# EAGLE design DAC_GainOutputStage7 (EAGLE 9.6.2)
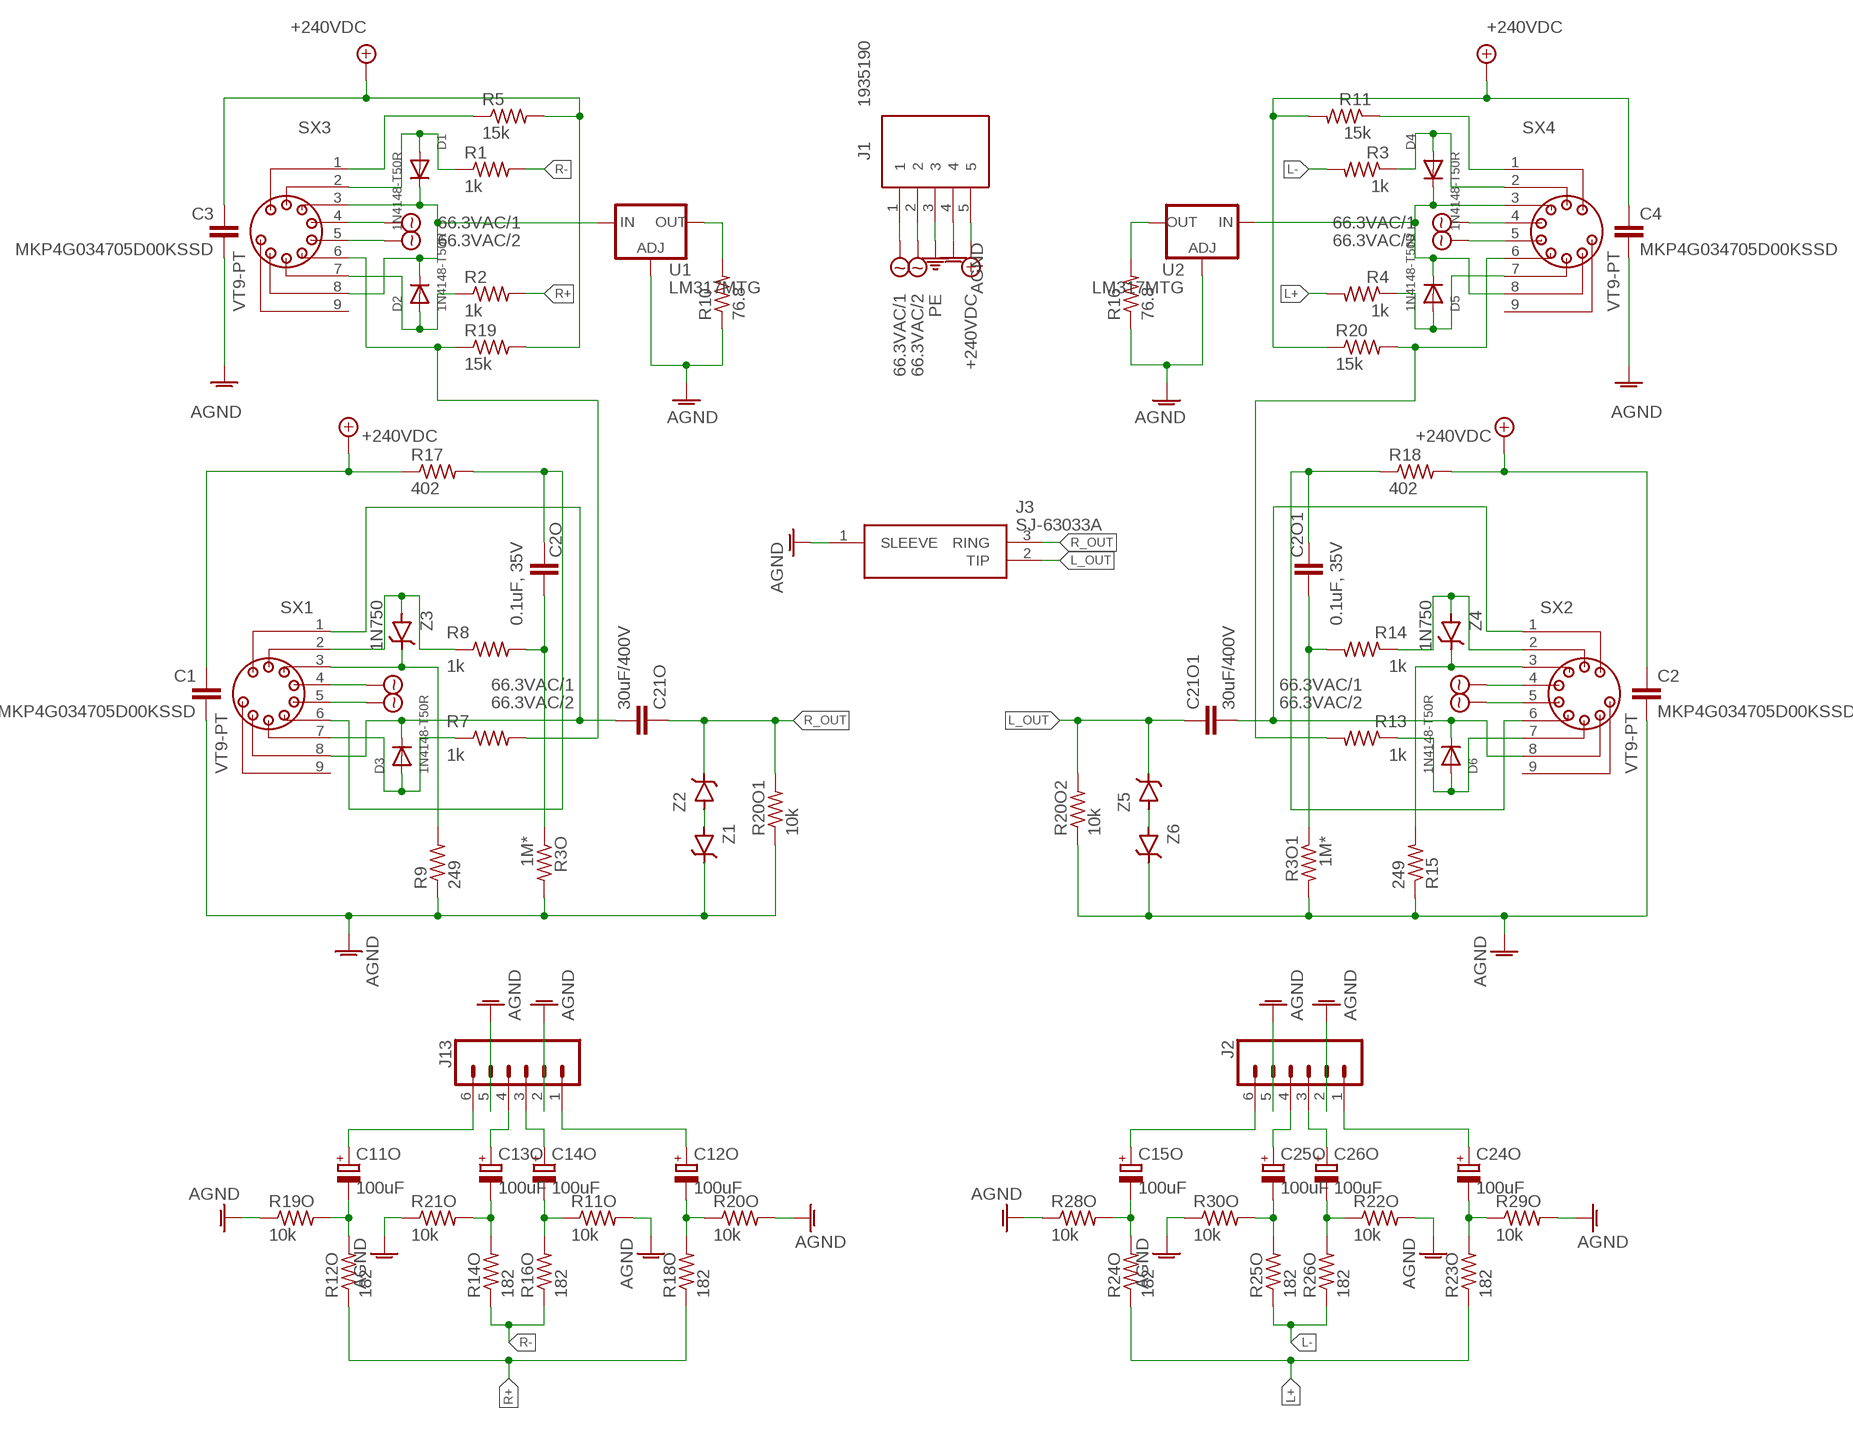
[diagram p0: schematic, sheet 1]

## Parts
C1  MKP4G034705D00KSSD  [MKP4G034705D00KSSD]
C2  MKP4G034705D00KSSD  [MKP4G034705D00KSSD]
C2O  0.1uF, 35V  MKS4B031002A00JC00  [MKS4B031002A00JC00]
C2O1  0.1uF, 35V  MKS4B031002A00JC00  [MKS4B031002A00JC00]
C3  MKP4G034705D00KSSD  [MKP4G034705D00KSSD]
C4  MKP4G034705D00KSSD  [MKP4G034705D00KSSD]
C11O  100uF  UFW1H101MPD1TD  [CAPPRD350W60D825H1300]
C12O  100uF  UFW1H101MPD1TD  [CAPPRD350W60D825H1300]
C13O  100uF  UFW1H101MPD1TD  [CAPPRD350W60D825H1300]
C14O  100uF  UFW1H101MPD1TD  [CAPPRD350W60D825H1300]
C15O  100uF  UFW1H101MPD1TD  [CAPPRD350W60D825H1300]
C21O  30uF/400V  DCP4G053006ID2KSSD  [DCP4G053006ID2KSSD]
C21O1  30uF/400V  DCP4G053006ID2KSSD  [DCP4G053006ID2KSSD]
C24O  100uF  UFW1H101MPD1TD  [CAPPRD350W60D825H1300]
C25O  100uF  UFW1H101MPD1TD  [CAPPRD350W60D825H1300]
C26O  100uF  UFW1H101MPD1TD  [CAPPRD350W60D825H1300]
D1  1N4148-T50R  [DIOAD1068W53L380D172]
D2  1N4148-T50R  [DIOAD1068W53L380D172]
D3  1N4148-T50R  [DIOAD1068W53L380D172]
D4  1N4148-T50R  [DIOAD1068W53L380D172]
D5  1N4148-T50R  [DIOAD1068W53L380D172]
D6  1N4148-T50R  [DIOAD1068W53L380D172]
J1  1935190  [1935190]
J2  CONN_06SILK_FEMALE_PTH  [1X06]
J3  SJ-63033A  [SJ63033A]
J13  CONN_06SILK_FEMALE_PTH  [1X06]
R1  1k  LR1F1K0  [0207/10]
R2  1k  LR1F1K0  [0207/10]
R3  1k  LR1F1K0  [0207/10]
R3O  1M*  LR1F1M0  [0207/10]
R3O1  1M*  LR1F1M0  [0207/10]
R4  1k  LR1F1K0  [0207/10]
R5  15k  CPF215K000FKE14  [0411/15]
R7  1k  LR1F1K0  [0207/10]
R8  1k  LR1F1K0  [0207/10]
R9  249  MBB02070C2490FRP00  [0207/10]
R10  76.8  YR1B76R8CC  [0207/10]
R11  15k  CPF215K000FKE14  [0411/15]
R11O  10k  LR1F10K  [0207/10]
R12O  182  MF0207FTE52-182R  [0207/10]
R13  1k  LR1F1K0  [0207/10]
R14  1k  LR1F1K0  [0207/10]
R14O  182  MF0207FTE52-182R  [0207/10]
R15  249  MBB02070C2490FRP00  [0207/10]
R16  76.8  YR1B76R8CC  [0207/10]
R16O  182  MF0207FTE52-182R  [0207/10]
R17  402  RWR80S4020FRB12  [0617/22]
R18  402  RWR80S4020FRB12  [0617/22]
R18O  182  MF0207FTE52-182R  [0207/10]
R19  15k  CPF215K000FKE14  [0411/15]
R19O  10k  LR1F10K  [0207/10]
R20  15k  CPF215K000FKE14  [0411/15]
R20O  10k  LR1F10K  [0207/10]
R20O1  10k  LR1F10K  [0207/10]
R20O2  10k  LR1F10K  [0207/10]
R21O  10k  LR1F10K  [0207/10]
R22O  10k  LR1F10K  [0207/10]
R23O  182  MF0207FTE52-182R  [0207/10]
R24O  182  MF0207FTE52-182R  [0207/10]
R25O  182  MF0207FTE52-182R  [0207/10]
R26O  182  MF0207FTE52-182R  [0207/10]
R28O  10k  LR1F10K  [0207/10]
R29O  10k  LR1F10K  [0207/10]
R30O  10k  LR1F10K  [0207/10]
SX1  VT9-PT  [VT9-PT]
SX2  VT9-PT  [VT9-PT]
SX3  VT9-PT  [VT9-PT]
SX4  VT9-PT  [VT9-PT]
U1  LM317MTG  [TO254P482X997X2018-3P]
U2  LM317MTG  [TO254P482X997X2018-3P]
Z1  BZX79-C16,113  [DIOAD1165W56L425D185]
Z2  BZX79-C16,113  [DIOAD1165W56L425D185]
Z3  1N750  [DIOAD1256W56L444D203]
Z4  1N750  [DIOAD1256W56L444D203]
Z5  BZX79-C16,113  [DIOAD1165W56L425D185]
Z6  BZX79-C16,113  [DIOAD1165W56L425D185]

## Nets
66.3VAC/1 [Power]: J1.1 SX1.4 SX2.4 SX3.4 SX4.4
66.3VAC/2 [Power]: J1.2 SX1.5 SX2.5 SX3.5 SX4.5
+240VDC [Power]: C1.1 C2.1 C3.1 C4.1 J1.5 R5.2 R11.2 R17.1 R18.2 R19.2 R20.1
AGND [Power]: C1.2 C2.2 C3.2 C4.2 J1.4 J2.2 J2.5 J3.1(SLEEVE) J13.2 J13.5 R3O1.2 R3O.2 R9.1 R10.1 R11O.2 R15.1 R16.1 R19O.1 R20O1.1 R20O2.1 R20O.2 R21O.1 R22O.2 R28O.1 R29O.2 R30O.1 U1.1(ADJ) U2.1(ADJ) Z1.1(C) Z6.1(C)
L+ [Signal]: R4.2 R23O.1 R24O.1
L- [Signal]: R3.2 R25O.1 R26O.1
L_OUT [Signal]: C21O1.1 J3.2(TIP) R20O2.2 Z5.1(C)
N$1: R7.2 R19.1 SX3.6
N$2: R8.1 SX1.2 Z3.2(A)
N$3: C21O1.2 D6.1(C) SX2.1 SX2.8
N$4: D4.2(A) R3.1 SX4.2
N$5: D5.2(A) R4.1 SX4.7
N$6: D1.2(A) R1.1 SX3.2
N$7 [Power]: D4.1(C) D5.1(C) SX4.3 SX4.8 U2.3(IN)
N$8: R11.1 SX4.1
N$9: R13.2 R20.2 SX4.6
N$10: C11O.1(+) J13.6
N$11: C11O.2(-) R12O.2 R19O.2
N$12: C15O.1(+) J2.6
N$13: D2.2(A) R2.1 SX3.7
N$14: R14.1 SX2.2 Z4.2(A)
N$15: C12O.1(+) J13.1
N$16: C2O.2 R3O.1 R8.2
N$17: C2O1.2 R3O1.1 R14.2
N$18: C21O.2 D3.1(C) SX1.1 SX1.8
N$19: C12O.2(-) R18O.2 R20O.1
N$20: C15O.2(-) R24O.2 R28O.2
N$21: C13O.1(+) J13.4
N$22 [Power]: D1.1(C) D2.1(C) SX3.3 SX3.8 U1.3(IN)
N$23: D3.2(A) R7.1 SX1.7
N$24: C14O.1(+) J13.3
N$25: C14O.2(-) R11O.1 R16O.2
N$26: R9.2 SX1.3 Z3.1(C)
N$27: R15.2 SX2.3 Z4.1(C)
N$28: C13O.2(-) R14O.2 R21O.2
N$29: D6.2(A) R13.1 SX2.7
N$30: C24O.1(+) J2.1
N$31: C24O.2(-) R23O.2 R29O.1
N$32: C25O.1(+) J2.4
N$33: C26O.1(+) J2.3
N$34: C26O.2(-) R22O.1 R26O.2
N$35: R5.1 SX3.1
N$36: C25O.2(-) R25O.2 R30O.2
N$37: R10.2 U1.2(OUT)
N$38: R16.2 U2.2(OUT)
N$39 [Power]: C2O.1 R17.2 SX1.6
N$40 [Power]: C2O1.1 R18.1 SX2.6
N$41: Z1.2(A) Z2.2(A)
N$42: Z5.2(A) Z6.2(A)
PE [Power]: J1.3
R+ [Signal]: R2.2 R12O.1 R18O.1
R- [Signal]: R1.2 R14O.1 R16O.1
R_OUT [Signal]: C21O.1 J3.3(RING) R20O1.2 Z2.1(C)
Unconnected: SX1.9 SX2.9 SX3.9 SX4.9

## Library data of the parts
C1-C4 = Dual Mono Amp Library:MKP4G034705D00KSSD: 0.47 F Film Capacitor 220V 400V Polypropylene (PP), Metallized Radial Source: Datasheet <https://www.wima.de/wp-content/uploads/media/e_WIMA_MKP_4.pdf>; DESCRIPTION: 0.47 F Film Capacitor 220V 400V Polypropylene (PP), Metallized Radial; HEIGHT: 16.5mm; MANUFACTURER_NAME: WIMA; MANUFACTURER_PART_NUMBER: MKP4G034705D00KSSD; MOUSER_PART_NUMBER: 505-MKP4G034705DKSSD; MOUSER_PRICE-STOCK: http://www.mouser.com/Search/ProductDetail.aspx?qs=sJjjjplDs9uaOctv9bTMfA%3d%3d
C2O C2O1 = Dual Mono Amp Library:MKS4B031002A00JC00: Film Capacitors MKS 4 0.1 uF 50 VDC 2.5x7x10 PCM 7.5 Source: Datasheet <https://www.wima.de/wp-content/uploads/media/e_WIMA_MKS_4.pdf>; DESCRIPTION: Film Capacitors MKS 4 0.1 uF 50 VDC 2.5x7x10 PCM 7.5; HEIGHT: 7mm; MANUFACTURER_NAME: WIMA; MANUFACTURER_PART_NUMBER: MKS4B031002A00JC00; MOUSER_PART_NUMBER: 505-MKS4B0312AJC; MOUSER_PRICE-STOCK: https://www.mouser.co.uk/ProductDetail/WIMA/MKS4B031002A00JC00?qs=2G4irm%2FqADy9MV8AUfKNYA%3D%3D
C11O C12O C13O C14O C15O C24O C25O C26O = Dual Mono Amp Library:UFW1H101MPD1TD: Aluminum Electrolytic Capacitors - Radial Leaded 100uF 50 Volts 20% Source: Datasheet <https://www.nichicon.co.jp/english/series_items/catalog_pdf/e-ufw.pdf>; ARROW_PART_NUMBER: UFW1H101MPD1TD; ARROW_PRICE-STOCK: https://www.arrow.com/en/products/ufw1h101mpd1td/nichicon; DESCRIPTION: Aluminum Electrolytic Capacitors - Radial Leaded 100uF 50 Volts 20%; HEIGHT: 13mm; MANUFACTURER_NAME: Nichicon; MANUFACTURER_PART_NUMBER: UFW1H101MPD1TD; MOUSER_PART_NUMBER: 647-UFW1H101MPD1TD; MOUSER_PRICE-STOCK: https://www.mouser.co.uk/ProductDetail/Nichicon/UFW1H101MPD1TD?qs=WJSLByB5Mu30jPPJ2KiG3A%3D%3D
C21O C21O1 = Dual Mono Amp Library:DCP4G053006ID2KSSD: Film Capacitors DC-LINK MKP 4 30.0 uF 400 VDC 17x34.5x31.5 PCM 27.5 Source: Datasheet <https://www.wima.de/wp-content/uploads/media/e_WIMA_DC_Link_MKP_4.pdf>; DESCRIPTION: Film Capacitors DC-LINK MKP 4 30.0 uF 400 VDC 17x34.5x31.5 PCM 27.5; HEIGHT: 34.5mm; MANUFACTURER_NAME: WIMA; MANUFACTURER_PART_NUMBER: DCP4G053006ID2KSSD; MOUSER_PART_NUMBER: 505-DCP4G0536ID2KSSD; MOUSER_PRICE-STOCK: https://www.mouser.co.uk/ProductDetail/WIMA/DCP4G053006ID2KSSD?qs=RB4whv9F6rwxZ2Ey0tRejg%3D%3D
D1-D6 = Dual Mono Amp Library:1N4148-T50R: Diodes - General Purpose, Power, Switching Hi Conductance Fast Source: Datasheet <https://www.onsemi.com/pub/Collateral/1N914-D.PDF>; DESCRIPTION: Diodes - General Purpose, Power, Switching Hi Conductance Fast; HEIGHT: mm; MANUFACTURER_NAME: onsemi; MANUFACTURER_PART_NUMBER: 1N4148-T50R; MOUSER_PART_NUMBER: 512-1N4148T50R; MOUSER_PRICE-STOCK: https://www.mouser.co.uk/ProductDetail/onsemi-Fairchild/1N4148-T50R?qs=0lQeLiL1qyZS6rosZp7Ehg%3D%3D
J1 = Dual Mono Amp Library:1935190: PCB terminal block, nominal current: 17.5 A, rated voltage (III/2): 400 V, nominal cross section: 1.5 mm?, Number of potentials: 5, Number of rows: 1, Number of positions per row: 5, product range: PT 1,5/..-H, pitch: 5 mm, connection method: Screw connection with wire protector, mounting: Wave soldering, conductor/PCB connection direction: 0 ?, color: green, Pin layout: Linear pinning, Solder pin [P]: 3.5 mm, type of packaging: packed in cardboard Source: Datasheet <https://www.phoenixcontact.com/online/portal/us/pxc/product_detail_page/!ut/p/z1/3Vdbc5pAFP4r5sG3rLsLLEJn-oDGlJjEYsQqvDDssma24RZETf31Xbyk1Wn1IeN0CnNm2D2c853L8jEc6MMp9NNwKZ7DUmRpGMu95-uB23F7PUfR8dch6aC7G9LtPWhP2B4o8Bv0oV-GFHq4WsWCFmHxA3qLOU8rRS4i-chUCTZRtc>; DESCRIPTION: PCB terminal block, nominal current: 17.5 A, rated voltage (III/2): 400 V, nominal cross section: 1.5 mm?, Number of potentials: 5, Number of rows: 1, Number of positions per row: 5, product range: PT 1,5/..-H, pitch: 5 mm, connection method: Screw connection with wire protector, mounting: Wave soldering, conductor/PCB connection direction: 0 ?, color: green, Pin layout: Linear pinning, Solder pin [P]: 3.5 mm, type of packaging: packed in cardboard; HEIGHT: 11.55mm; MANUFACTURER_NAME: Phoenix Contact; MANUFACTURER_PART_NUMBER: 1935190; MOUSER_PART_NUMBER: 651-1935190; MOUSER_PRICE-STOCK: https://www.mouser.co.uk/ProductDetail/Phoenix-Contact/1935190?qs=QWULklcAmSS%2FS46GSzyZOw%3D%3D
J2 J13 = Dual Mono Amp Library:CONN_06: Multi connection point. Often used as Generic Header-pin footprint for 0.1 inch spaced/style header connections On any of the 0.1 inch spaced packages, you can populate with these: Break Away Headers - Straight <https://www.sparkfun.com/products/116> (PRT-00116) Break Away Male Headers - Right Angle <https://www.sparkfun.com/products/553> (PRT-00553) Female Headers <https://www.sparkfun.com/products/115> (PRT-00115) Break Away Headers - Machine Pin <https://www.sparkfun.com/products/117> (PRT-00117) Break Away Female Headers - Swiss Machine Pin <https://www.sparkfun.com/products/743> (PRT-00743) Arduino Stackable Header - 6 Pin <https://www.sparkfun.com/products/9280> (PRT-09280) Screw Terminals 2.54mm Pitch (6-Pin) <https://www.sparkfun.com/products/16499> (PRT-16499) For SCREWTERMINALS and SPRING TERMINALS visit here: Screw Terimnals on SparkFun.com <https://www.sparkfun.com/search/results?term=Screw+Terminals> (5mm/3.5mm/2.54mm spacing) This device is also useful as a general connection point to wire up your design to another part of your project. Our various solder wires solder well into these plated through hole pads. Hook-Up Wire - Assortment (Stranded, 22 AWG) <https://www.sparkfun.com/products/11375> (PRT-11375) Hook-Up Wire - Assortment (Solid Core, 22 AWG) <https://www.sparkfun.com/products/11367> (PRT-11367) View the entire wire category on our website here <https://www.sparkfun.com/categories/141>; PROD_ID: CONN-08437
J3 = Dual Mono Amp Library:SJ-63033A: 6.35 mm, Stereo, Right Angle, Through Hole Mount, 3 Conductors, 0 Internal Switches, Audio Jack Connector Source: Datasheet <https://www.cuidevices.com/product/resource/sj-63033a.pdf>; DESCRIPTION: 6.35 mm, Stereo, Right Angle, Through Hole Mount, 3 Conductors, 0 Internal Switches, Audio Jack Connector; HEIGHT: 12.3mm; MANUFACTURER_NAME: CUI Devices; MANUFACTURER_PART_NUMBER: SJ-63033A
R1-R4 R7 R8 R13 R14 = Dual Mono Amp Library:LR1F1K0: Body Features: Lead Type Axial-Leaded | Configuration Features: Number of Resistors 1 | Dimensions: Passive Component Dimensions 6.2 x 2.3 MM | Electrical Characteristics: Passive Component Tolerance 1 PCT | Resistance Value 1K OHM | Operating Voltage 350 V | Power Rating .6 WATT | Resistance Class 1k 1M | Packaging Features: Packaging Method Ammo Packed | Product Type Features: Element Type Thin Film | Resistor Type General Purpose Resistor | Termination Features: Termination Area Base Material Cop Source: Datasheet <https://www.te.com/commerce/DocumentDelivery/DDEController?Action=srchrtrv&DocNm=1773241&DocType=Data Sheet&DocLang=English&PartCntxt=1622349-1&DocFormat=pdf>; DESCRIPTION: Body Features: Lead Type Axial-Leaded | Configuration Features: Number of Resistors 1 | Dimensions: Passive Component Dimensions 6.2 x 2.3 MM | Electrical Characteristics: Passive Component Tolerance 1 PCT | Resistance Value 1K OHM | Operating Voltage 350 V | Power Rating .6 WATT | Resistance Class 1k 1M | Packaging Features: Packaging Method Ammo Packed | Product Type Features: Element Type Thin Film | Resistor Type General Purpose Resistor | Termination Features: Termination Area Base Material Cop; HEIGHT: mm; MANUFACTURER_NAME: TE Connectivity; MANUFACTURER_PART_NUMBER: LR1F1K0; MOUSER_PART_NUMBER: 279-LR1F1K0; MOUSER_PRICE-STOCK: https://www.mouser.co.uk/ProductDetail/TE-Connectivity-Holsworthy/LR1F1K0?qs=ip69W3eHERVhMxNSZkerTg%3D%3D
R3O R3O1 = Dual Mono Amp Library:LR1F1M0: TE Connectivity Axial Metal Film Resistor 1m +/-1% 0.6W +/-50ppm/C Source: Datasheet <https://www.te.com/commerce/DocumentDelivery/DDEController?Action=showdoc&DocId=Data Sheet1773241GpdfEnglishENG_DS_1773241_G.pdf1622367-1>; DESCRIPTION: TE Connectivity Axial Metal Film Resistor 1m +/-1% 0.6W +/-50ppm/C; HEIGHT: mm; MANUFACTURER_NAME: TE Connectivity; MANUFACTURER_PART_NUMBER: LR1F1M0; MOUSER_PART_NUMBER: 279-LR1F1M0; MOUSER_PRICE-STOCK: https://www.mouser.co.uk/ProductDetail/TE-Connectivity-Holsworthy/LR1F1M0?qs=ip69W3eHERVt%2FmQVAugcSg%3D%3D
R5 R11 R19 R20 = Dual Mono Amp Library:CPF215K000FKE14: VISHAY - CPF215K000FKE14 - Through Hole Resistor, 15 kohm, CPF Series, 2 W, +/- 1%, Axial Leaded, 500 V Source: Datasheet <https://www.vishay.com/doc?31021>; DESCRIPTION: VISHAY - CPF215K000FKE14 - Through Hole Resistor, 15 kohm, CPF Series, 2 W, +/- 1%, Axial Leaded, 500 V; HEIGHT: mm; MANUFACTURER_NAME: Vishay; MANUFACTURER_PART_NUMBER: CPF215K000FKE14; MOUSER_PART_NUMBER: 71-CPF2-F-15K-E3; MOUSER_PRICE-STOCK: https://www.mouser.com/ProductDetail/71-CPF2-F-15K-E3
R9 R15 = Dual Mono Amp Library:MBB02070C2490FRP00: Metal Film Resistors - Through Hole 249ohm 1% 0.6W Metal Film Resistor Source: Datasheet; DESCRIPTION: Metal Film Resistors - Through Hole 249ohm 1% 0.6W Metal Film Resistor; HEIGHT: mm; MANUFACTURER_NAME: VISHAY; MANUFACTURER_PART_NUMBER: MBB02070C2490FRP00
R10 R16 = Dual Mono Amp Library:YR1B76R8CC: Body Features: Lead Type Axial-Leaded | Configuration Features: Number of Resistors 1 | Dimensions: Passive Component Dimensions 6.3 x 2.3 MM | Electrical Characteristics: Resistance Class Up to 1k | Power Rating .25 WATT | Operating Voltage 250 V | Passive Component Tolerance .1 PCT | Resistance Value 76.8 OHM | Packaging Features: Packaging Method Ammo Packed | Product Type Features: Resistor Type Precision Resistor | Element Type Thin Film | Termination Features: Number of Terminations 2 | Termination Source: Datasheet <https://www.te.com/commerce/DocumentDelivery/DDEController?Action=srchrtrv&DocNm=1309350_PASSIVE_COMPONENT&DocType=Catalog Section&DocLang=English&PartCntxt=2-1879027-1&DocFormat=pdf>; DESCRIPTION: Body Features: Lead Type Axial-Leaded | Configuration Features: Number of Resistors 1 | Dimensions: Passive Component Dimensions 6.3 x 2.3 MM | Electrical Characteristics: Resistance Class Up to 1k | Power Rating .25 WATT | Operating Voltage 250 V | Passive Component Tolerance .1 PCT | Resistance Value 76.8 OHM | Packaging Features: Packaging Method Ammo Packed | Product Type Features: Resistor Type Precision Resistor | Element Type Thin Film | Termination Features: Number of Terminations 2 | Termination; HEIGHT: mm; MANUFACTURER_NAME: TE Connectivity; MANUFACTURER_PART_NUMBER: YR1B76R8CC
R11O R19O R20O R20O1 R20O2 R21O R22O R28O R29O R30O = Dual Mono Amp Library:LR1F10K: Metal film resistor, 10K 0.6W TE Connectivity LR1F Series Axial Metal Film Resistor 10k Source: Datasheet <https://datasheet.datasheetarchive.com/originals/distributors/DKDS-21/401716.pdf>; DESCRIPTION: Metal film resistor, 10K 0.6W TE Connectivity LR1F Series Axial Metal Film Resistor 10k; HEIGHT: mm; MANUFACTURER_NAME: TE Connectivity; MANUFACTURER_PART_NUMBER: LR1F10K; MOUSER_PART_NUMBER: 279-LR1F10K; MOUSER_PRICE-STOCK: https://www.mouser.co.uk/ProductDetail/TE-Connectivity-Holsworthy/LR1F10K?qs=ip69W3eHERWDLLWs2Qv0Lg%3D%3D
R12O R14O R16O R18O R23O R24O R25O R26O = Dual Mono Amp Library:MF0207FTE52-182R: Metal Film Resistors - Through Hole 0.6W 1% 182 ohm 50pp m Source: Datasheet <https://www.mouser.com/datasheet/2/447/YAGEO_MF0_datasheet_2021v1-3003020.pdf>; DESCRIPTION: Metal Film Resistors - Through Hole 0.6W 1% 182 ohm 50pp m; HEIGHT: mm; MANUFACTURER: Yageo; MANUFACTURER_PART_NUMBER: MF0207FTE52-182R; MOUSER_PART_NUMBER: 603-MF0207FTE52-182R; MOUSER_PRICE-STOCK: https://www.mouser.com/ProductDetail/YAGEO/MF0207FTE52-182R?qs=KUIzHt%2Fe91leK267FaM40g%3D%3D
R17 R18 = Dual Mono Amp Library:RWR80S4020FRB12: Metal Film Resistors - Through Hole 402 OHM 2W 1% Source: Datasheet; DESCRIPTION: Metal Film Resistors - Through Hole 402 OHM 2W 1%; HEIGHT: mm; MANUFACTURER_NAME: VISHAY; MANUFACTURER_PART_NUMBER: RWR80S4020FRB12
SX1-SX4 = Dual Mono Amp Library:VT9: VACUUM TUBE SOCKET Source: 00004280-VT9-PT.pdf
U1 U2 = Dual Mono Amp Library:LM317MTG: Internal Short Circuit Current Limiting; Internal Thermal Overload Protection; Output Current in Excess of 500 mA; Output Transistor Safe-Area Compensation; Output Adjustable between 1.2 V and 37 V; Floating Operation for High Voltage Applications; Eliminates Stocking Many Fixed Voltages; Pb-Free Packages are Available; NCV Prefix for Automotive and Other Applications Requiring Site Control Changes Source: Datasheet <https://www.onsemi.com/pub/Collateral/LM317M-D.PDF>; DESCRIPTION: Internal Short Circuit Current Limiting; Internal Thermal Overload Protection; Output Current in Excess of 500 mA; Output Transistor Safe-Area Compensation; Output Adjustable between 1.2 V and 37 V; Floating Operation for High Voltage Applications; Eliminates Stocking Many Fixed Voltages; Pb-Free Packages are Available; NCV Prefix for Automotive and Other Applications Requiring Site Control Changes; HEIGHT: 4.82mm; MANUFACTURER_NAME: onsemi; MANUFACTURER_PART_NUMBER: LM317MTG; MOUSER_PART_NUMBER: 863-LM317MTG; MOUSER_PRICE-STOCK: https://www.mouser.co.uk/ProductDetail/onsemi/LM317MTG?qs=2OtswVQKCOHbXYkL9fERIw%3D%3D
Z1 Z2 Z5 Z6 = Dual Mono Amp Library:BZX79-C16,113: Nexperia Zener Diode, 16V +/-2 %, +/-5 % 500 mW Through Hole 2-Pin SOD27 (DO-35) Source: Datasheet <https://assets.nexperia.com/documents/data-sheet/BZX79.pdf>; DESCRIPTION: Nexperia Zener Diode, 16V +/-2 %, +/-5 % 500 mW Through Hole 2-Pin SOD27 (DO-35); HEIGHT: mm; MANUFACTURER_NAME: Nexperia; MANUFACTURER_PART_NUMBER: BZX79-C16,113
Z3 Z4 = Dual Mono Amp Library:1N750: Zener Diodes Voltage Regulator Source: Datasheet <https://www.microsemi.com/document-portal/doc_view/10928-sa5-7-datasheet>; DESCRIPTION: Zener Diodes Voltage Regulator; HEIGHT: mm; MANUFACTURER_NAME: Microsemi Corporation; MANUFACTURER_PART_NUMBER: 1N750; MOUSER_PART_NUMBER: 494-1N750(DO-35); MOUSER_PRICE-STOCK: https://www.mouser.co.uk/ProductDetail/Microchip-Microsemi/1N750?qs=Xwz%252BGKGy4sB1rzIdx4SmVg%3D%3D

## Net classes
1 Signal: width 1.27 mm
2 Power: width 2.54 mm

## Board
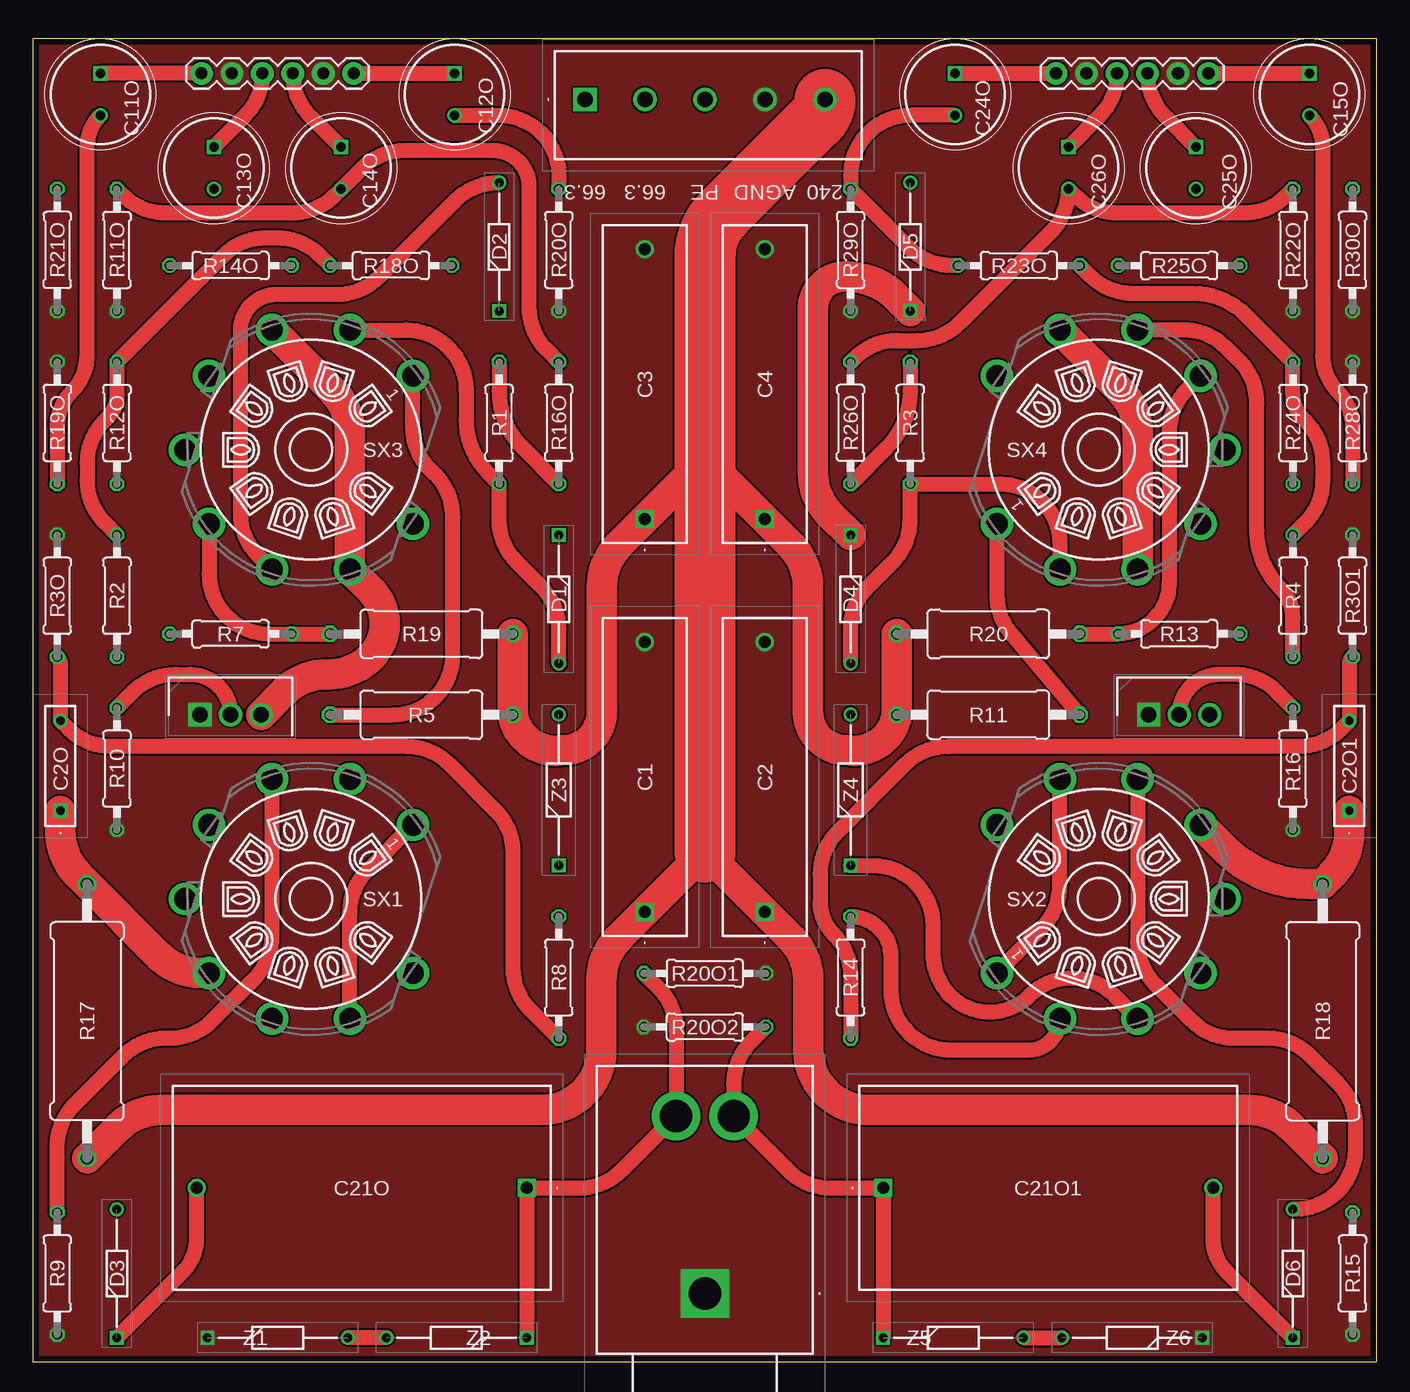
[diagram p1: board, top side]
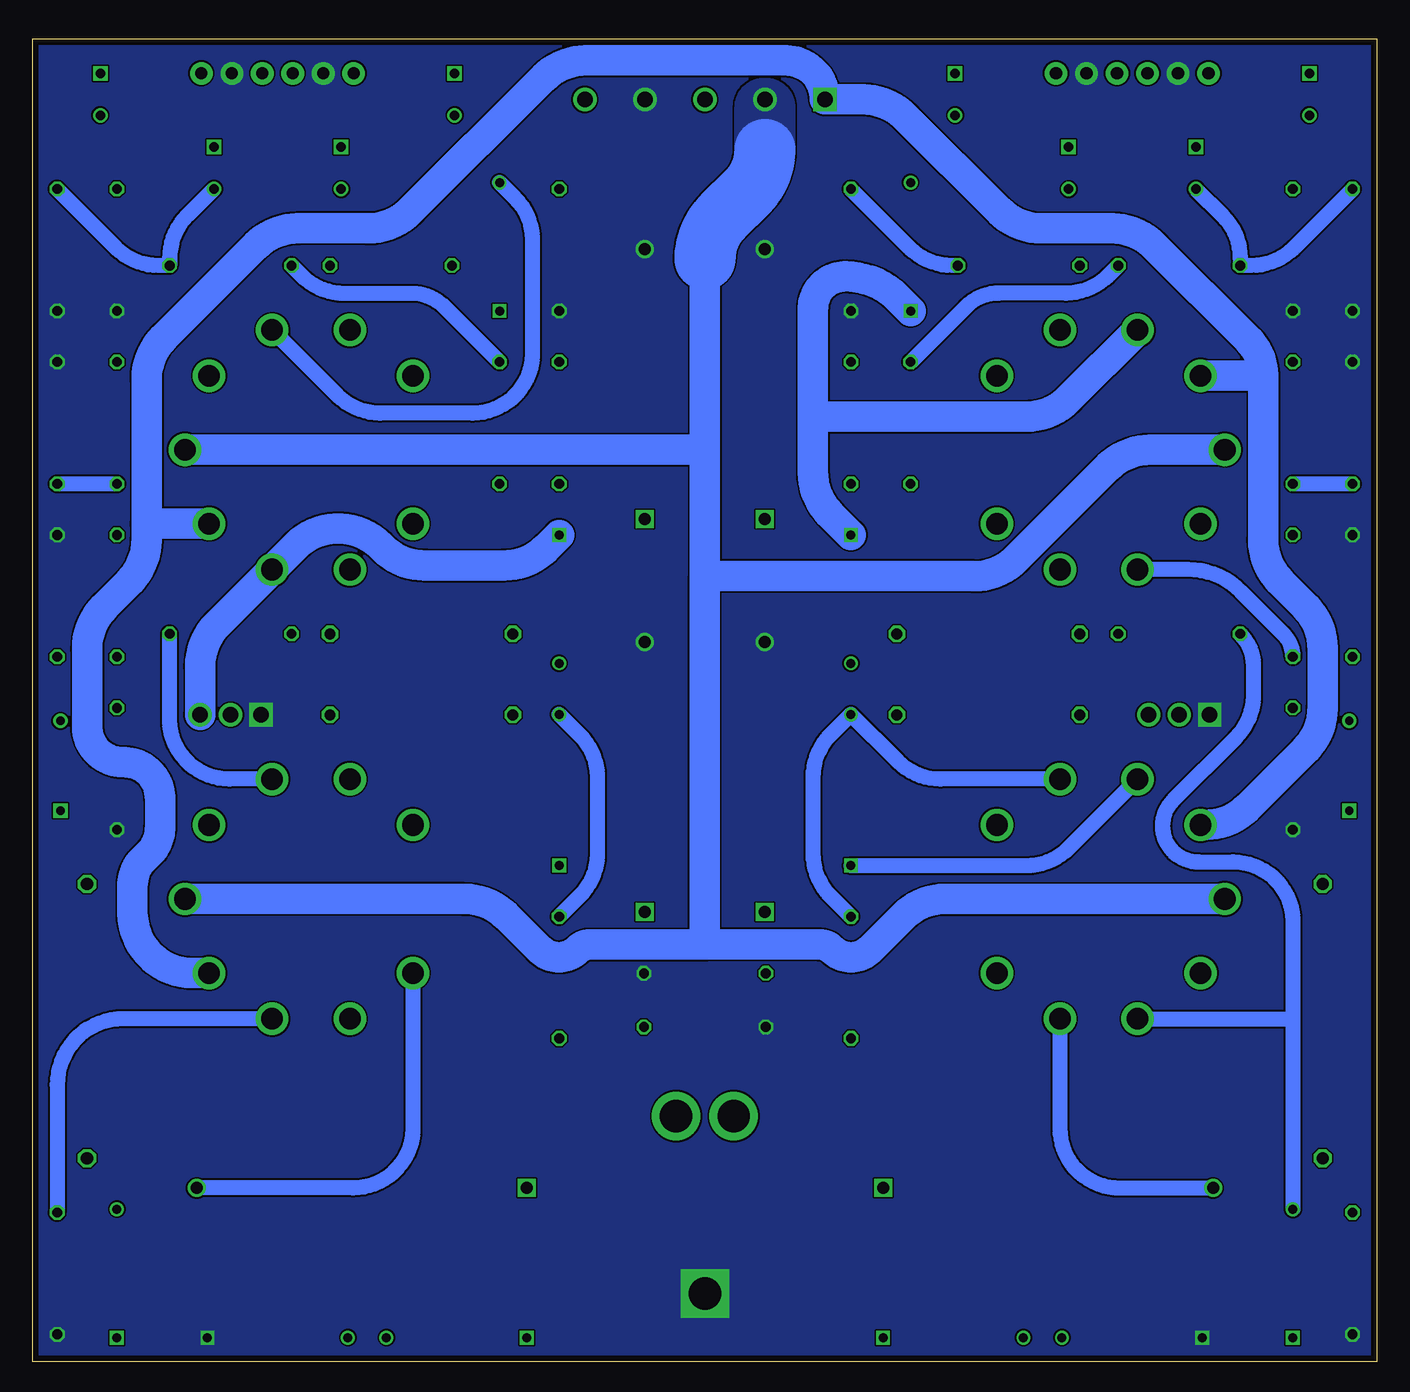
[diagram p2: board, bottom side, seen from below]

Size 112 x 110.3 mm. Coordinates in mm from the lower left corner, seen from the top.
Outline: 0,0 112,0 112,110.3 0,110.3 0,0
Copper layers (1*16): Top 0.035mm / dielectric 1.6mm / Bottom 0.035mm
Design rules "Elecrow_2-layer_PCB_eagle_rule": minimum track width 6mil, minimum drill 12mil, track to track 6mil, track to pad 6mil, pad to pad 6mil, via to via 8mil, smd to smd 0mil, copper to edge 20mil, drill to drill 10mil, minimum pad ring 6mil, minimum via ring 6mil, stop-mask expansion 0mil, vias tented up to drill 100mil, thermal gap 10mil

### Footprints (pad centres in the part's own frame; a part is rotated, then mirrored left to right if it is on the bottom)
MKP4G034705D00KSSD = drill 1 pad 1.5 square: 1 0,0 | drill 1 pad 1.5: 2 22.5,0
MKS4B031002A00JC00 = drill 0.7 pad 1.2 square: 1 0,0 | drill 0.7 pad 1.2: 2 7.5,0
CAPPRD350W60D825H1300 = drill 0.8 pad 1.2 square: 1 0,0 | drill 0.8 pad 1.2: 2 3.5,0
DCP4G053006ID2KSSD = drill 1 pad 1.5 square: 1 0,0 | drill 1 pad 1.5: 2 27.5,0
DIOAD1068W53L380D172 = drill 0.75 pad 1.15 square: 1 0,0 | drill 0.75 pad 1.15: 2 10.7,0
1935190 = drill 1.3 pad 1.95 square: 1 0,0 | drill 1.3 pad 1.95: 2 5,0; 3 10,0; 4 15,0; 5 20,0
1X06 = drill 1.016 pad 1.88: 1 0,0; 2 2.54,0; 3 5.08,0; 4 7.62,0; 5 10.16,0; 6 12.7,0
SJ63033A = drill 2.69 pad 4.035 square: 1 0,0 | drill 2.69 pad 4.035: 2 14.8,-2.4; 3 14.8,2.4
0207/10 = drill 0.813 octagon: 1 -5.08,0; 2 5.08,0
0411/15 = drill 0.914 octagon: 1 -7.62,0; 2 7.62,0
0617/22 = drill 1.016 octagon: 1 -11.43,0; 2 11.43,0
VT9-PT = drill 1.8 pad 2.4: 1 6.172,8.495; 2 0,10.5; 3 -6.172,8.495; 4 -9.986,3.245; 5 -9.986,-3.245; 6 -6.172,-8.495; 7 0,-10.5; 8 6.172,-8.495; 9 9.986,-3.244
TO254P482X997X2018-3P = drill 1.29 pad 1.935 square: 1 0,0 | drill 1.29 pad 1.935: 2 2.54,0; 3 5.08,0
DIOAD1165W56L425D185 = drill 0.75 pad 1.15 square: 1 0,0 | drill 0.75 pad 1.15: 2 11.7,0
DIOAD1256W56L444D203 = drill 0.75 pad 1.15 square: 1 0,0 | drill 0.75 pad 1.15: 2 12.6,0

### Placement (x,y rotation side)
C1  51,37.5 90 top
C2  61,37.5 90 top
C2O  2.3,45.95 90 top
C2O1  109.7,45.95 90 top
C3  51,70.25 90 top
C4  61,70.25 90 top
C11O  5.62,107.42 270 top
C12O  35.15,107.42 270 top
C13O  15.08,101.28 270 top
C14O  25.69,101.28 270 top
C15O  106.38,107.42 270 top
C21O  41.15,14.5 180 top
C21O1  70.85,14.5 0 top
C24O  76.85,107.42 270 top
C25O  96.92,101.28 270 top
C26O  86.31,101.28 270 top
D1  43.83,68.95 270 top
D2  38.86,87.62 90 top
D3  7,2.03 90 top
D4  68.14,68.95 270 top
D5  73.11,87.62 90 top
D6  105,2.03 90 top
J1  46,105.25 0 top
J2  85.26,107.42 0 top
J3  56,5.7 90 top
J13  26.74,107.42 180 top
R1  38.86,78.28 90 top
R2  7,63.87 90 top
R3  73.11,78.28 90 top
R3O  2.03,63.87 90 top
R3O1  109.97,63.87 90 top
R4  105,63.87 90 top
R5  32.38,53.95 0 top
R7  16.48,60.7 0 top
R8  43.83,32.05 270 top
R9  2.03,7.38 90 top
R10  7,49.45 90 top
R11  79.62,53.95 180 top
R11O  7,92.7 270 top
R12O  7,78.28 270 top
R13  95.52,60.7 180 top
R14  68.14,32.05 270 top
R14O  16.48,91.4 180 top
R15  109.97,7.38 90 top
R16  105,49.45 90 top
R16O  43.83,78.28 90 top
R17  4.52,28.42 90 top
R18  107.48,28.42 270 top
R18O  29.84,91.4 0 top
R19  32.38,60.7 0 top
R19O  2.03,78.28 270 top
R20  79.62,60.7 0 top
R20O  43.83,92.7 270 top
R20O1  56,32.4 180 top
R20O2  56,27.93 0 top
R21O  2.03,92.7 90 top
R22O  105,92.7 270 top
R23O  82.16,91.4 180 top
R24O  105,78.28 270 top
R25O  95.52,91.4 0 top
R26O  68.14,78.28 90 top
R28O  109.97,78.28 270 top
R29O  68.14,92.7 270 top
R30O  109.97,92.7 90 top
SX1  23.18,38.6 342 top
SX2  88.82,38.6 162 top
SX3  23.18,76.05 342 top
SX4  88.82,76.05 162 top
U1  13.94,53.95 0 top
U2  92.98,53.95 0 top
Z1  14.55,2.03 0 top
Z2  41.15,2.03 180 top
Z3  43.83,41.39 90 top
Z4  68.14,41.39 90 top
Z5  70.85,2.03 0 top
Z6  97.45,2.03 180 top

### Tracks (layer width: path | path; a pad name or v marks a point on that pad's centre or on a via)
66.3VAC/1
  Bottom 2.54: 9.47,82.22 arc-45 10.72,85.22 18.54,93.04 arc-45 22.07,94.5 27.93,94.5 arc45 31.46,95.96 39.29,103.79 arc-45 42.82,105.25 J1.1 arc-90 49.25,108.5 65.93,108.5 arc-45 69.46,107.04 80.54,95.96 arc45 84.07,94.5 89.93,94.5 arc-45 93.46,93.04 101.06,85.44 arc-45 102.53,81.9 102.53,69.88 | SX3.4 9.47,82.22 | 9.47,82.22 9.47,68.55 arc-45 8.01,65.01 5.98,62.98 arc45 4.52,59.45 4.52,54.55 arc45 5.98,51.02 10.76,46.24 arc45 14.3,44.77 SX1.4 | 102.53,69.88 102.53,68.55 arc45 103.99,65.01 106.02,62.98 arc-45 107.48,59.45 107.48,53 arc-90 104.48,50 104.4,50 arc90 101.4,47 101.4,44.54 arc45 102.28,42.42 102.82,41.88 arc-45 103.7,39.76 103.7,37.43 arc-90 98.7,32.43 SX2.4 | SX4.4 102.53,69.88
66.3VAC/2
  Bottom 2.54: 56,65.5 33.57,65.5 arc-45 30.04,66.96 22.42,74.58 arc45 18.88,76.05 SX3.5 | SX4.5 56,76.05 | SX1.5 35.95,38.6 arc-45 39.49,37.14 42.23,34.39 arc90 45.41,34.39 arc-45 46.41,34.8 56,34.8 | SX2.5 76.05,38.6 arc45 72.51,37.14 69.77,34.39 arc-90 66.58,34.39 arc45 65.59,34.8 56,34.8 | 56,91.93 56,76.05 | 56,76.05 56,65.5 | 56,34.8 56,65.5 | 56,34.8
  Bottom 5.08: 51,101.07 arc45 52.46,97.54 54.54,95.46 arc-45 56,91.93
  pour Bottom (no thermals): 48.46,101.07 48.46,104.54 arc-90 51,107.08 arc-90 53.54,104.54 53.54,101.07
+240VDC
  Top 2.54: R18.2 104.93,19.54 arc45 101.4,21 69.63,21 arc-90 64.63,26 64.63,31.8 arc45 63.16,35.34 C2.1 56,42.5 C1.1 48.84,35.34 arc45 47.37,31.8 47.37,26 arc-90 42.37,21 10.6,21 arc45 7.07,19.54 R17.1 | R19.2 R5.2 arc90 44.2,51 arc90 47.41,54.21 47.41,64.59 arc-45 48.88,68.13 C3.1 56,75.25 C4.1 63.12,68.13 arc-45 64.59,64.59 64.59,54.21 arc90 67.8,51 arc90 R11.2 R20.1
  Top 5.08: J1.5 arc-45 65.29,103.54 57.46,95.71 arc45 56,92.18 56,75.25 56,42.5
AGND
  pour Bottom (rank 6, no thermals): 0,0 112,0 112,110.3 0,110.3
  pour Top (rank 6, no thermals): 0,0 112,0 112,110.3 0,110.3
L+
  Top 1.27: R23O.1 88.08,90.56 arc45 91.61,89.1 96.69,89.1 arc-45 101.08,87.28 R24O.1 105,80.59 arc45 105.77,78.73 106.02,78.48 arc-45 107.48,74.94 107.48,73.5 arc-45 106.02,69.97 R4.2
L-
  Top 1.27: R3.2 73.11,80.95 arc-45 71.14,76.21 R26O.1
  Bottom 1.27: R25O.1 89.61,90.56 arc-45 86.07,89.1 80.42,89.1 arc45 77.73,87.99 R3.2
L_OUT
  Top 1.27: R20O2.2 59.86,26.71 arc45 58.4,23.18 J3.2 62.94,15.96 arc45 66.47,14.5 C21O1.1 Z5.1
N$1
  Top 1.27: R19.1 R7.2 19.68,60.7 arc-90 14.68,65.7 SX3.6
N$2
  Bottom 1.27: SX1.2 36.35,48.59 arc45 39.89,50.05 Z3.2 45.54,52.28 arc-45 47,48.74 47,42.38 arc-45 45.54,38.84 R8.1
N$3
  Top 1.27: D6.1 99.46,7.57 arc-45 98.35,10.25 C21O1.2 | SX2.1 84.11,36.22 arc45 85.58,39.75 SX2.8
  Bottom 1.27: SX2.1 80.33,19.5 arc90 85.33,14.5 C21O1.2
N$4
  Top 1.27: SX4.2 85.58,68.2 arc90 80.58,73.2 R3.1 73.11,70.22 arc-45 71.64,66.68 69.6,64.64 arc45 68.14,61.1 D4.2
N$5
  Top 1.27: R4.1 105,62.04 arc45 103.96,64.54 arc-45 102,69.28 102,79.93 arc45 100.54,83.46 99.43,84.57 arc45 95.89,86.03 SX4.7
  Bottom 1.27: D5.2 71.84,97.05 arc45 70.37,93.51 70.37,84.1 arc90 75.37,79.1 83.06,79.1 arc45 86.6,80.56 SX4.7
N$6
  Top 1.27: SX3.2 31.1,86.03 arc-90 36.1,81.03 36.1,78.53 arc45 37.92,74.14 R1.1 38.85,70.22 arc45 40.32,66.68 42.36,64.64 arc-45 43.83,61.1 D1.2
N$7
  Top 2.54: D5.1 72.05,88.68 arc45 67.66,90.5 arc90 65,87.84 65,74.16 arc45 66.46,70.62 D4.1 | SX4.8 90.6,81.01 arc-45 92.07,77.47 SX4.3
  Bottom 2.54: D4.1 69.22,67.86 arc45 72.76,66.4 79.33,66.4 arc45 82.86,67.86 83.03,68.03 arc-90 90.1,68.03 SX4.3 96.6,61.53 arc-45 98.06,57.99 U2.3
N$8
  Top 1.27: SX4.1 80.33,63.95 arc40 81.51,60.72 R11.1
N$9
  Top 1.27: R20.2 R13.2 arc90 94.69,64.94 94.69,77.52 arc-45 96.16,81.06 SX4.6
N$10
  Top 1.27: J13.6 C11O.1
N$11
  Top 1.27: R19O.2 2.03,77.91 arc-45 3.3,80.97 arc45 4.52,83.91 4.52,101.25 arc-45 C11O.2
  Bottom 1.27: R19O.2 R12O.2
N$12
  Top 1.27: J2.6 C15O.1
N$13
  Top 1.27: D2.2 38.79,98.32 arc45 35.26,96.86 28.86,90.46 arc-45 25.33,89 20.31,89 arc90 17.31,86 17.31,70.76 arc45 18.77,67.22 SX3.7
  Bottom 1.27: R2.1 arc-45 7.79,60.69 11.35,64.25 arc-45 15.73,66.06 SX3.7
N$14
  Top 1.27: R14.1 arc-90 71.5,33.77 71.5,31 arc90 76.5,26 82.96,26 arc90 SX2.2
  Bottom 1.27: Z4.2 66.43,52.28 arc45 64.96,48.74 64.96,42.38 arc45 66.43,38.84 R14.1
N$15
  Top 1.27: J13.1 C12O.1
N$16
  Top 1.27: R8.2 41.46,29.33 arc-45 40,32.87 40,42.46 arc45 38.54,45.99 34.69,49.84 arc45 31.16,51.3 6.52,51.3 arc-45 2.99,52.76 C2O.2 2.3,58.14 arc45 R3O.1
N$17
  Top 1.27: R3O1.1 arc45 109.7,58.14 C2O1.2 109.02,52.76 arc-45 105.48,51.3 76.24,51.3 arc45 72.71,49.84 67.06,44.19 arc45 65.6,40.66 65.6,38.32 arc45 66.67,35.73 arc-45 68.14,32.19 R14.2
N$18
  Top 1.27: D3.1 12.54,7.57 arc45 13.65,10.25 C21O.2 | SX1.8 26.42,37.45 arc-45 27.89,40.99 SX1.1
  Bottom 1.27: SX1.8 26.42,19.5 arc-90 21.42,14.5 C21O.2
N$19
  Top 1.27: C12O.2 38.83,103.92 arc-90 43.83,98.92 R20O.1
  Bottom 1.27: R18O.2 35.37,91.4 arc45 38.91,92.86 R20O.1
N$20
  Top 1.27: R28O.2 109.97,77.91 arc45 108.7,80.97 arc-45 107.48,83.91 107.48,101.25 arc45 C15O.2
  Bottom 1.27: R24O.2 R28O.2
N$21
  Top 1.27: J13.4 19.12,107.38 arc-45 17.65,103.85 C13O.1
N$22
  Top 2.54: U1.3 20.92,55.86 arc-45 24.46,57.33 24.65,57.33 arc45 28.19,58.79 arc90 28.19,64.3 SX3.8 26.42,77.47 arc45 24.96,81.01 SX3.3
  Bottom 2.54: D2.1 39.92,88.68 arc-45 44.31,90.5 arc-90 47,87.81 47,78.8 | 47,78.8 47,74.19 arc-45 45.54,70.66 D1.1 | 47,78.8 29.24,78.8 arc-45 25.7,80.26 SX3.3
N$23
  Bottom 1.27: R7.1 arc45 10.3,58.05 10.3,55.57 arc45 11.76,52.04 16.99,46.81 arc-135 14.87,41.69 12,41.69 arc90 7,36.69 7,28.62 | SX1.7 7,28.62 | 7,28.62 D3.2
N$24
  Top 1.27: J13.3 21.66,107.38 arc45 23.12,103.85 C14O.1
N$25
  Top 1.27: R11O.1 7.52,97.26 arc45 11.05,95.8 21.64,95.8 arc45 25.17,97.26 C14O.2 27.45,99.54 arc-45 30.98,101 38.34,101 arc-90 41.34,98 41.34,87.92 arc45 42.8,84.38 R16O.2
N$26
  Top 1.27: R9.2 2.03,17.96 arc-45 3.5,21.5 7.54,25.54 arc-45 11.07,27 11.43,27 arc45 14.96,28.46 18.47,31.97 arc45 19.93,35.5 SX1.3
  Bottom 1.27: Z3.1 29.2,41.39 arc-45 25.67,42.85 SX1.3
N$27
  Top 1.27: Z4.1 70,41.39 arc-90 75,36.39 75,34.07 arc45 76.46,30.54 arc90 83.04,30.54 83.06,30.56 arc-90 90.13,30.56 SX2.3
  Bottom 1.27: SX2.3 104.47,28.61 arc-90 109.97,23.11 R15.2
N$28
  Bottom 1.27: C13O.2 12.86,95.56 arc45 11.39,92.02 R14O.2 10.48,91.4 arc-45 6.95,92.86 R21O.2
N$29
  Top 1.27: SX2.7 92.07,35 arc45 93.53,31.47 96.54,28.46 arc45 100.07,27 102.93,27 arc-45 106.46,25.54 108.74,23.26 arc-45 110.2,19.73 110.2,17.73 arc-90 105.2,12.73 D6.2
  Bottom 1.27: SX2.7 95.61,48.59 arc90 100.61,53.59 R13.1
N$30
  Top 1.27: C24O.1 J2.1
N$31
  Top 1.27: R23O.2 76.59,91.4 arc-45 73.06,92.86 R29O.1 68.14,98.92 arc-90 73.14,103.92 C24O.2
N$32
  Top 1.27: J2.4 92.88,107.38 arc45 94.35,103.85 C25O.1
N$33
  Top 1.27: J2.3 90.34,107.38 arc-45 88.88,103.85 C26O.1
N$34
  Top 1.27: R26O.2 68.48,83.7 arc-45 72.01,85.17 73.72,85.17 arc45 77.26,86.63 84.85,94.22 arc45 86.31,97.75 C26O.2 86.83,97.26 arc45 90.36,95.8 100.95,95.8 arc45 104.48,97.26 R22O.1
N$35
  Top 1.27: SX3.1 31.67,77.9 arc45 33.14,74.36 33.54,73.96 arc-45 35,70.43 35,58.95 arc-90 30,53.95 R5.1
N$36
  Bottom 1.27: C25O.2 99.14,95.56 arc-45 100.61,92.02 R25O.2 101.52,91.4 arc45 105.05,92.86 R30O.2
N$37
  Top 1.27: R10.2 8.33,55.86 arc-45 11.87,57.33 13.1,57.33 arc-90 U1.2
N$38
  Top 1.27: R16.2 103.67,55.86 arc45 100.13,57.33 98.9,57.33 arc90 U2.2
N$39
  Top 2.54: C2O.1 2.3,44.13 arc45 3.76,40.6 R17.2 10.47,33.89 arc45 14,32.43 SX1.6
N$40
  Top 2.54: C2O1.1 109.7,44.13 arc-45 108.24,40.6 R18.1 106.39,39.84 arc-45 99.32,42.77 SX2.6
N$41
  Top 1.27: Z2.2 Z1.2
N$42
  Top 1.27: Z5.2 Z6.2
R+
  Top 1.27: R2.2 5.98,69.97 arc-45 4.52,73.5 4.52,74.94 arc-45 5.98,78.48 6.23,78.73 arc45 7,80.59 R12O.1 15.87,92.24 arc-45 19.41,93.7 20.39,93.7 arc-45 23.92,92.24 R18O.1
R-
  Top 1.27: R1.2 38.85,80.95 arc45 40.82,76.21 R16O.1
  Bottom 1.27: R14O.1 22.39,90.56 arc45 25.93,89.1 31.55,89.1 arc-45 34.23,87.99 R1.2
R_OUT
  Top 1.27: R20O1.2 52.14,31.18 arc-45 53.6,27.65 J3.3 49.06,15.96 arc-45 45.53,14.5 C21O.1 Z2.1

### Text on the board
tPlace: 66.3 | 66.3 | PE | AGND | 240